# EAGLE schematic Adafruit Hallowing M4 (EAGLE 9.4.2)
COMPANY: ADAFRUIT INDUSTRIES; DRAWN: KTOWN; REV: B
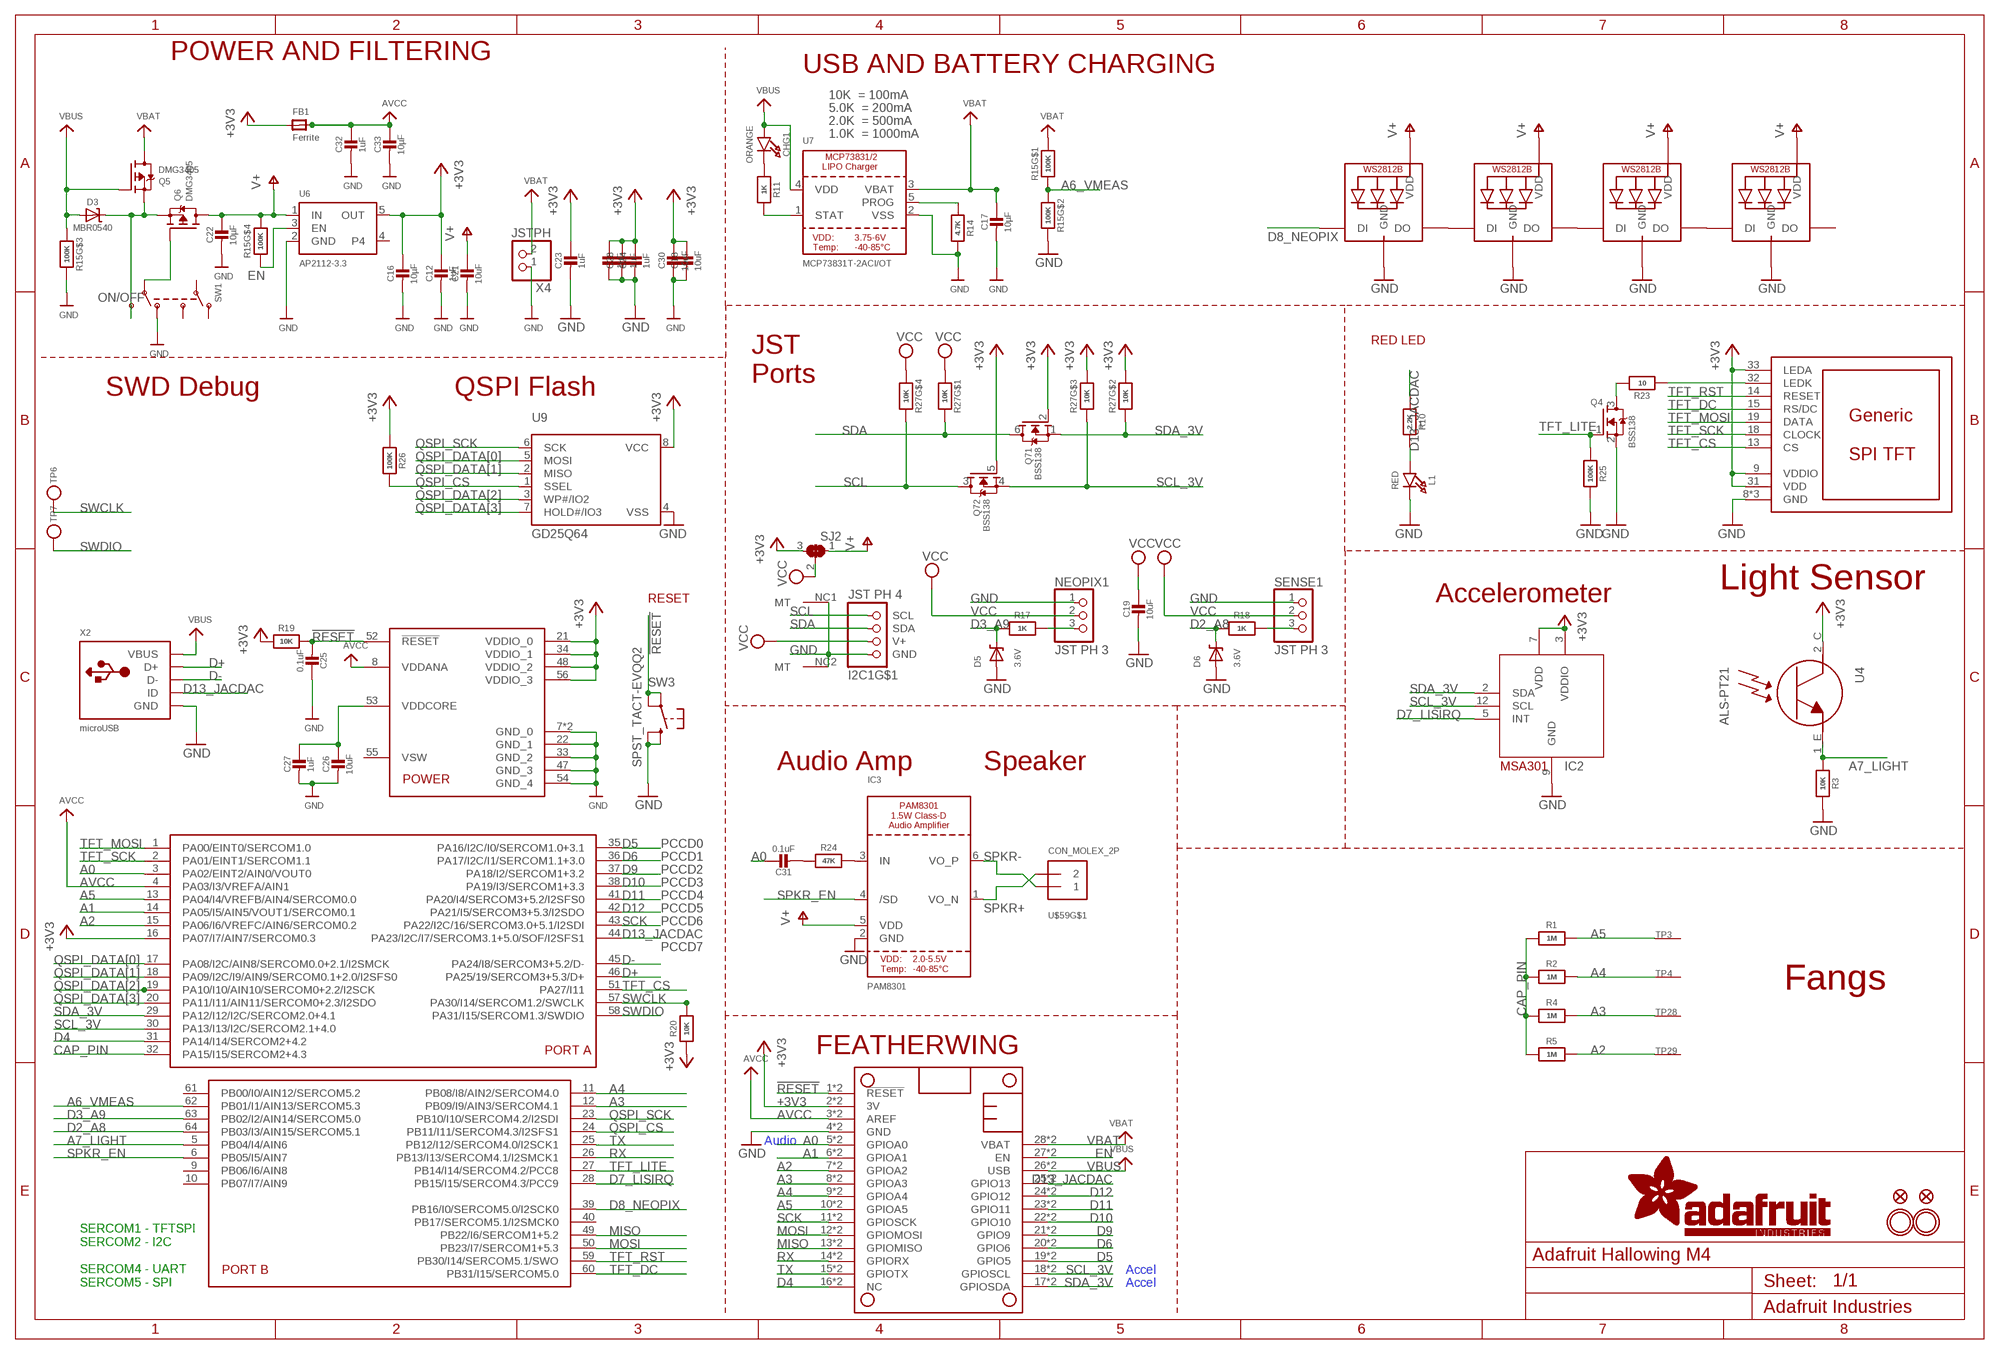
[diagram p0: schematic, sheet 1]

## Parts
C12  1uF  CAP_CERAMIC0603_NO  [0603-NO]
C16  10µF  CAP_CERAMIC0805-NOOUTLINE  [0805-NO]
C17  10µF  CAP_CERAMIC0805-NOOUTLINE  [0805-NO]
C18  10uF  CAP_CERAMIC0805-NOOUTLINE  [0805-NO]
C19  10uF  CAP_CERAMIC0805-NOOUTLINE  [0805-NO]
C21  10uF  CAP_CERAMIC0805-NOOUTLINE  [0805-NO]
C22  10µF  CAP_CERAMIC0805-NOOUTLINE  [0805-NO]
C23  1uF  CAP_CERAMIC0603_NO  [0603-NO]
C24  1uF  CAP_CERAMIC0603_NO  [0603-NO]
C25  0.1uF  CAP_CERAMIC0603_NO  [0603-NO]
C26  10uF  CAP_CERAMIC0805-NOOUTLINE  [0805-NO]
C27  1uF  CAP_CERAMIC0603_NO  [0603-NO]
C28  1uF  CAP_CERAMIC0603_NO  [0603-NO]
C29  1uF  CAP_CERAMIC0603_NO  [0603-NO]
C30  10uF  CAP_CERAMIC0805-NOOUTLINE  [0805-NO]
C31  0.1uF  CAP_CERAMIC0603_NO  [0603-NO]
C32  1uF  CAP_CERAMIC0603_NO  [0603-NO]
C33  10µF  CAP_CERAMIC0805-NOOUTLINE  [0805-NO]
CHG1  ORANGE  LED0805_NOOUTLINE  [CHIPLED_0805_NOOUTLINE]
D3  MBR0540  DIODE-SCHOTTKYSOD-123  [SOD-123]
D5  3.6V  DIODE-ZENERSOD323  [SOD-323]
D6  3.6V  DIODE-ZENERSOD323  [SOD-323]
FB1  Ferrite  FERRITE-0805NO  [0805-NO]
I2C1  JST PH 4  STEMMA_I2C_RASMT  [JSTPH4]
IC2  MSA301  [LGA12_2X2MM]
IC3  PAM8301  [SOT23-6]
L1  RED  LED0805_NOOUTLINE  [CHIPLED_0805_NOOUTLINE]
LED1  WS2812B_4020  [WS2812B_4020]
LED2  WS2812B_4020  [WS2812B_4020]
LED3  WS2812B_4020  [WS2812B_4020]
LED4  WS2812B_4020  [WS2812B_4020]
MS2  FEATHERWING_SMTDUALNOHOLES  [FEATHERWING_SMT_NOHOLES]
NEOPIX1  JST PH 3  CON_JST_PH_3PIN  [JSTPH3]
Q4  BSS138  MOSFET-NWIDE  [SOT23-WIDE]
Q5  DMG3405  MOSFET-P  [SOT23-R]
Q6  DMG3405  MOSFET-P  [SOT23-R]
Q7  BSS138  MOSFET-N_DUAL  [SOT363]
R1  1M  RESISTOR_0603_NOOUT  [0603-NO]
R2  1M  RESISTOR_0603_NOOUT  [0603-NO]
R3  10K  RESISTOR_0603_NOOUT  [0603-NO]
R4  1M  RESISTOR_0603_NOOUT  [0603-NO]
R5  1M  RESISTOR_0603_NOOUT  [0603-NO]
R10  2.2K  RESISTOR_0603_NOOUT  [0603-NO]
R11  1K  RESISTOR_0603_NOOUT  [0603-NO]
R14  4.7K  RESISTOR_0603_NOOUT  [0603-NO]
R15  100K  RESISTOR_4PACK  [RESPACK_4X0603]
R17  1K  RESISTOR_0603_NOOUT  [0603-NO]
R18  1K  RESISTOR_0603_NOOUT  [0603-NO]
R19  10K  RESISTOR_0603_NOOUT  [0603-NO]
R20  10K  RESISTOR_0603_NOOUT  [0603-NO]
R23  10  RESISTOR_0603_NOOUT  [0603-NO]
R24  47K  RESISTOR_0603_NOOUT  [0603-NO]
R25  100K  RESISTOR_0603_NOOUT  [0603-NO]
R26  100K  RESISTOR_0603_NOOUT  [0603-NO]
R27  10K  RESISTOR_4PACK  [RESPACK_4X0603]
SENSE1  JST PH 3  CON_JST_PH_3PIN  [JSTPH3]
SJ2  SOLDERJUMPER_2WAY  [SOLDERJUMPER_2WAY_OPEN_NOPASTE]
SW1  SWITCH_DPDTEG1390  [EG1390]
SW3  SPST_TACT-EVQQ2  SWITCH_TACT_SMT4.6X2.8  [BTN_KMR2_4.6X2.8]
TFT1  DISP_LCD_GENERIC_SPITFT_VDDIO_1.54_240X240_HANDSOLDER  [TFT_1.54IN_240X240_HANDSOLDER]
TP3  SEWTAP_ALLILONG  [PCB_ALLI_LONG]
TP4  SEWTAPPCB_ALLIGATOR  [PCB_ALLI]
TP6  TESTPOINTROUND1.5MM  [TESTPOINT_ROUND_1.5MM]
TP7  TESTPOINTROUND1.5MM  [TESTPOINT_ROUND_1.5MM]
TP28  SEWTAPPCB_ALLIGATOR  [PCB_ALLI]
TP29  SEWTAP_ALLILONG  [PCB_ALLI_LONG]
U4  ALS-PT21  PHOTOTRANSISTOR_PT26-21C  [ALS-PT26-21C]
U6  AP2112-3.3  VREG_SOT23-5  [SOT23-5]
U7  MCP73831T-2ACI/OT  MCP73831/2  [SOT23-5]
U9  GD25Q64  SPIFLASH_8PIN208MIL  [SOIC8_208MIL]
U$31  MOUNTINGHOLE2.5  [MOUNTINGHOLE_2.5_PLATED]
U$32  MOUNTINGHOLE2.5  [MOUNTINGHOLE_2.5_PLATED]
U$34  FIDUCIAL_1MM  [FIDUCIAL_1MM]
U$35  FIDUCIAL_1MM  [FIDUCIAL_1MM]
U$59  CON_MOLEX_2P  [53398-0271]
U$63  ATSAMD51J19  ATSAMD51J  [PQFN64-1]
X2  microUSB  USB_MICRO_20329_V2  [4UCONN_20329_V2]
X4  JSTPH  CON_JST_PH_2PIN  [JSTPH2]

## Nets
!RESET: C25.2 MS2.1(!RESET) MS2.1B(!RESET) R19.2 SW3.A'(P1) SW3.A(P) U$63.52(!RESET)
+3V3 [power]: C12.1 C16.1 C18.1 C23.1 C24.1 C28.1 C29.1 C30.1 FB1.1 IC2.3(VDDIO) IC2.7(VDD) MS2.2(3V) MS2.2B(3V) Q7.2(1:G) Q7.5(2:G) R19.1 R20.1 R26.1 R27.2 R27.3 SJ2.3 TFT1.9(VDDIO) TFT1.31(VDD) TFT1.33(LEDA) U4.2_C(C) U6.5(OUT) U9.8(VCC) U$63.16(PA07/I7/AIN7/SERCOM0.3) U$63.21(VDDIO_0) U$63.34(VDDIO_1) U$63.48(VDDIO_2) U$63.56(VDDIO_3)
A0: C31.1 MS2.5(GPIOA0) MS2.5B(GPIOA0) U$63.3(PA02/EINT2/AIN0/VOUT0)
A1: MS2.6(GPIOA1) MS2.6B(GPIOA1) U$63.14(PA05/I5/AIN5/VOUT1/SERCOM0.1)
A2: MS2.7(GPIOA2) MS2.7B(GPIOA2) R5.1 TP29.P$1(SEW) U$63.15(PA06/I6/VREFC/AIN6/SERCOM0.2)
A3: MS2.8(GPIOA3) MS2.8B(GPIOA3) R4.1 TP28.P$1(SEW) U$63.12(PB09/I9/AIN3/SERCOM4.1)
A4: MS2.9(GPIOA4) MS2.9B(GPIOA4) R2.1 TP4.P$1(SEW) U$63.11(PB08/I8/AIN2/SERCOM4.0)
A5: MS2.10(GPIOA5) MS2.10B(GPIOA5) R1.1 TP3.P$1(SEW) U$63.13(PA04/I4/VREFB/AIN4/SERCOM0.0)
A6_VMEAS: R15.1 R15.2 U$63.62(PB01/I1/AIN13/SERCOM5.3)
A7_LIGHT: R3.2 U4.1_E(E) U$63.5(PB04/I4/AIN6)
AVCC: C32.1 C33.1 FB1.2 MS2.3(AREF) MS2.3B(AREF) U$63.4(PA03/I3/VREFA/AIN1) U$63.8(VDDANA)
CAP_PIN: R1.2 R2.2 R4.2 R5.2 U$63.32(PA15/I15/SERCOM2+4.3)
CHG_LED1: R11.2 U7.1(STAT)
CHG_RATE1: R14.1 U7.5(PROG)
D2: R18.1 SENSE1.3
D2_A8: D6.C R18.2 U$63.64(PB03/I3/AIN15/SERCOM5.1)
D3: NEOPIX1.3 R17.1
D3_A9: D5.C R17.2 U$63.63(PB02/I2/AIN14/SERCOM5.0)
D4: MS2.16(NC) MS2.16B(NC) U$63.31(PA14/I14/SERCOM2+4.2)
D5: MS2.19(GPIO5) MS2.19B(GPIO5) U$63.35(PA16/I2C/I0/SERCOM1.0+3.1)
D6: MS2.20(GPIO6) MS2.20B(GPIO6) U$63.36(PA17/I2C/I1/SERCOM1.1+3.0)
D7_LISIRQ: IC2.5(INT) U$63.28(PB15/I15/SERCOM4.3/PCC9)
D8_NEOPIX: LED2.1(DI) U$63.39(PB16/I0/SERCOM5.0/I2SCK0)
D9: MS2.21(GPIO9) MS2.21B(GPIO9) U$63.37(PA18/I2/SERCOM1+3.2)
D10: MS2.22(GPIO10) MS2.22B(GPIO10) U$63.38(PA19/I3/SERCOM1+3.3)
D11: MS2.23(GPIO11) MS2.23B(GPIO11) U$63.41(PA20/I4/SERCOM3+5.2/I2SFS0)
D12: MS2.24(GPIO12) MS2.24B(GPIO12) U$63.42(PA21/I5/SERCOM3+5.3/I2SDO)
D13_JACDAC: MS2.25(GPIO13) MS2.25B(GPIO13) R10.1 U$63.44(PA23/I2C/I7/SERCOM3.1+5.0/SOF/I2SFS1) X2.ID
D+: U$63.46(PA25/19/SERCOM3+5.3/D+) X2.D+
D-: U$63.45(PA24/I8/SERCOM3+5.2/D-) X2.D-
EN: MS2.27(EN) MS2.27B(EN) R15.4 U6.3(EN)
GND: C12.2 C16.2 C17.2 C18.2 C19.2 C21.2 C22.2 C23.2 C24.2 C25.1 C26.2 C27.2 C28.2 C29.2 C30.2 C32.2 C33.2 D5.A D6.A I2C1.1(GND) I2C1.NC1(MT) I2C1.NC2(MT) IC2.9(GND) IC3.2(GND) L1.C LED1.4(GND) LED2.4(GND) LED3.4(GND) LED4.4(GND) MS2.4(GND) MS2.4B(GND) NEOPIX1.1 Q4.2(S) R3.1 R14.2 R15.6 R15.7 R25.2 SENSE1.1 SW1.O2 SW3.B'(S1) SW3.B(S) TFT1.8(GND) TFT1.21(GND) TFT1.22(GND) U6.2(GND) U7.2(VSS) U9.4(VSS) U$63.7(GND_0) U$63.22(GND_1) U$63.33(GND_2) U$63.47(GND_3) U$63.54(GND_4) U$63.EXP(GND_0) X2.BASE@1(GND) X2.BASE@2(GND) X2.GND X2.SPRT@1(GND) X2.SPRT@2(GND) X2.SPRT@3(GND) X2.SPRT@4(GND) X4.1
MISO: MS2.13(GPIOMISO) MS2.13B(GPIOMISO) U$63.49(PB22/I6/SERCOM1+5.2)
MOSI: MS2.12(GPIOMOSI) MS2.12B(GPIOMOSI) U$63.50(PB23/I7/SERCOM1+5.3)
N$1: R23.1 TFT1.32(LEDK)
N$3: L1.A R10.2
N$4: CHG1.C R11.1
N$5: D3.C Q5.2(S) Q6.2(S) SW1.S2
N$6: LED1.1(DI) LED2.3(DO)
N$7: LED1.3(DO) LED3.1(DI)
N$8: LED3.3(DO) LED4.1(DI)
N$12: Q4.3(D) R23.2
N$13: C31.2 R24.1
N$14: IC3.3(IN) R24.2
ON/OFF: Q6.1(G) SW1.P2
QSPI_CS: R26.2 U9.1(SSEL) U$63.24(PB11/I11/SERCOM4.3/I2SFS1)
QSPI_DATA[0]: U9.5(MOSI) U$63.17(PA08/I2C/AIN8/SERCOM0.0+2.1/I2SMCK)
QSPI_DATA[1]: U9.2(MISO) U$63.18(PA09/I2C/I9/AIN9/SERCOM0.1+2.0/I2SFS0)
QSPI_DATA[2]: U9.3(WP#/IO2) U$63.19(PA10/I10/AIN10/SERCOM0+2.2/I2SCK)
QSPI_DATA[3]: U9.7(HOLD#/IO3) U$63.20(PA11/I11/AIN11/SERCOM0+2.3/I2SDO)
QSPI_SCK: U9.6(SCK) U$63.23(PB10/I10/SERCOM4.2/I2SDI)
RX: MS2.14(GPIORX) MS2.14B(GPIORX) U$63.26(PB13/I13/SERCOM4.1/I2SMCK1)
SCK: MS2.11(GPIOSCK) MS2.11B(GPIOSCK) U$63.43(PA22/I2C/16/SERCOM3.0+5.1/I2SDI)
SCL: I2C1.4(SCL) Q7.3(2:D) R27.5
SCL_3V: IC2.12(SCL) MS2.18(GPIOSCL) MS2.18B(GPIOSCL) Q7.4(2:S) R27.6 U$63.30(PA13/I13/I2C/SERCOM2.1+4.0)
SDA: I2C1.3(SDA) Q7.6(1:D) R27.8
SDA_3V: IC2.2(SDA) MS2.17(GPIOSDA) MS2.17B(GPIOSDA) Q7.1(1:S) R27.7 U$63.29(PA12/I12/I2C/SERCOM2.0+4.1)
SPKR+: IC3.1(VO_N) U$59.2
SPKR-: IC3.6(VO_P) U$59.1
SPKR_EN: IC3.4(/SD) U$63.6(PB05/I5/AIN7)
SWCLK: R20.2 TP6.P$1 U$63.57(PA30/I14/SERCOM1.2/SWCLK)
SWDIO: TP7.P$1 U$63.58(PA31/I15/SERCOM1.3/SWDIO)
TFT_CS: TFT1.13(CS) U$63.51(PA27/I11)
TFT_DC: TFT1.15(RS/DC) U$63.60(PB31/I15/SERCOM5.0)
TFT_LITE: Q4.1(G) R25.1 U$63.27(PB14/I14/SERCOM4.2/PCC8)
TFT_MOSI: TFT1.19(DATA) U$63.1(PA00/EINT0/SERCOM1.0)
TFT_RST: TFT1.14(RESET) U$63.59(PB30/I14/SERCOM5.1/SWO)
TFT_SCK: TFT1.18(CLOCK) U$63.2(PA01/EINT1/SERCOM1.1)
TX: MS2.15(GPIOTX) MS2.15B(GPIOTX) U$63.25(PB12/I12/SERCOM4.0/I2SCK1)
V+ [power]: C21.1 C22.1 IC3.5(VDD) LED1.2(VDD) LED2.2(VDD) LED3.2(VDD) LED4.2(VDD) Q6.3(D) R15.5 SJ2.1 U6.1(IN)
VBAT [power]: C17.1 MS2.28(VBAT) MS2.28B(VBAT) Q5.3(D) R15.8 U7.3(VBAT) X4.2
VBUS [power]: CHG1.A D3.A MS2.26(USB) MS2.26B(USB) Q5.1(G) R15.3 U7.4(VDD) X2.VBUS
VCC [power]: C19.1 I2C1.2(V+) NEOPIX1.2 R27.1 R27.4 SENSE1.2 SJ2.2
VDDCORE2: C26.1 C27.1 U$63.53(VDDCORE)
Unconnected: LED4.3(DO) SW1.O1 SW1.P1 SW1.S1 U6.4 U$59.M1(MT) U$59.M2(MT) U$63.9(PB06/I6/AIN8) U$63.10(PB07/I7/AIN9) U$63.40(PB17/SERCOM5.1/I2SMCK0) U$63.55(VSW) U$63.61(PB00/I0/AIN12/SERCOM5.2)

## Notes on the sheet
- POWER AND FILTERING
- USB AND BATTERY CHARGING
- 10K  = 100mA
- 5.0K  = 200mA
- 2.0K  = 500mA
- 1.0K  = 1000mA
- RED LED
- JST
  Ports
- SWD Debug | QSPI Flash
- Light Sensor
- RESET | Accelerometer
- Audio Amp | Speaker
- PCCD0
- PCCD1
- PCCD2
- PCCD3
- PCCD4
- PCCD5
- PCCD6
- PCCD7
- Fangs
- FEATHERWING
- Audio
- Accel
- SERCOM1 - TFTSPI
  SERCOM2 - I2C
  
  SERCOM4 - UART
  SERCOM5 - SPI
- Accel

## Library data of the parts
C12 C17-C19 C21-C33 = microbuilder:CAP_CERAMIC: Ceramic Capacitors For new designs, use the packages preceded by an '_' character since they are more reliable: The following footprints should be used on most boards: _0402 - Standard footprint for regular board layouts _0603 - Standard footprint for regular board layouts _0805 - Standard footprint for regular board layouts _1206 - Standard footprint for regular board layouts For extremely tight-pitch boards where space is at a premium, the following 'micro-pitch' footprints can be used (smaller pads, no silkscreen outline, etc.): _0402MP - Micro-pitch footprint for very dense/compact boards _0603MP - Micro-pitch footprint for very dense/compact boards _0805MP - Micro-pitch footprint for very dense/compact boards _1206MP - Micro-pitch footprint for very dense/compact boards
C16 = microbuilder:CAP_CERAMIC: Ceramic Capacitors For new designs, use the packages preceded by an '_' character since they are more reliable: The following footprints should be used on most boards: _0402 - Standard footprint for regular board layouts _0603 - Standard footprint for regular board layouts _0805 - Standard footprint for regular board layouts _1206 - Standard footprint for regular board layouts For extremely tight-pitch boards where space is at a premium, the following 'micro-pitch' footprints can be used (smaller pads, no silkscreen outline, etc.): _0402MP - Micro-pitch footprint for very dense/compact boards _0603MP - Micro-pitch footprint for very dense/compact boards _0805MP - Micro-pitch footprint for very dense/compact boards _1206MP - Micro-pitch footprint for very dense/compact boards; REV: C
CHG1 L1 = microbuilder:LED: LED 0603 - 0603 Surface Mount Package 2mA: Green LED - Low Power (3.9mcd, 2ma, 1.7Vf) - Digikey: 475-2709-2-ND Orange LED - Low Power (9.8mcd, 2ma, 1.8Vf) - Digikey: 475-1194-2-ND Red LED - Low Power (5mcd, 2ma, 1.8Vf) - Digikey: 475-1195-2-ND Yellow LED - Low Power (7mcd, 2ma, 1.8Vf) - Digikey: 475-1196-2-ND 5mA: Blue LED - Low Power (17mcd, 5ma, 2.9Vf) - Digikey: LNJ937W8CRACT-ND 0805 - 0805 Surface Mount Package 2mA: Red LED (8.8mcd, 2mA, 1.8Vf, Clear) - Low Power [Digikey: 475-2510-1-ND] Green LED (5mcd, 2mA, 1.8Vf, Clear) - Low Power [Digikey: 475-2730-1-ND] Yellow LED (11.3mcd, 2mA, 1.8Vf, Clear) - Low Power [Digikey: 475-2555-1-ND] 20mA: Red LED (104mcd, 20mA, Diffused) - LS R976 [Digikey: 475-1278-6-ND] Red LED (12mcd, 20mA, 2.0Vf, Clear) - APT2012EC [Digikey: 754-1128-1-ND] Green LED (15mcd, 20mA, 2.2Vf, Clear) - APT2012GC [Digikey: 754-1131-1-ND] Orange LED (160mcd, 20mA, 2.1Vf, Clear) - APT2012SECK [Digikey: 754-1130-1-ND] 1206 - 1206 Surface Mount Package Green LED (26mcd, 20mA, Diffused) - LG N971 [Digikey: 475-1407-6-ND] Red LED (15mcd, 20mA, Diffused) - LH N974 [Digikey: 475-1416-6-ND] Cree - Cree High-Power Surface Mount LEDs XPEBWT-L1-0000-00D50 - White 111lm 350mA 2.9Vf 6200K 110° XTEAWT-00-0000-00000LEE3 - White 114lm 350mA 2.85Vf 5000K 115° Everlight - Everlight 45-21 Series Surface Mount LEDs 45-21/QK2C-B2832AC2CB2/2T - Warm White 2000mcd 20mA 3.25Vf 3050K 120° 45-21/LK2C-B38452C4CB2/2T - Nuetral White 2000mcd 20mA 3.25Vf 4150K 120° 45-21/LK2C-B50634C6CB2/2T - Cold White 2200mcd 20mA 3.25Vf 5650K 120° PLCC2 Reverse Mount LS T77K-J1L2-1-0-2-R18-Z - Red 11.25mcd 2mA 1.8Vf 630nm 120° LO T77K-L1M2-24-Z - Orange 19.6mcd 2mA 1.8Vf 606nm 120° LY T77K-K2M1-26-Z - Yellow 15.7mcd 2mA 1.8Vf 587nm 120°
D3 = microbuilder:DIODE-SCHOTTKY
D5 D6 = microbuilder:DIODE-ZENER: Zener Diode SMA: 30V 1W Zener Diode, 1.2Vf - Digikey: SMAZ30-FDICT-ND
FB1 = microbuilder:FERRITE: Ferrite Bead 0603 MMZ1608B121C - 120 Ohm @ 100MHz, 600mA, 0.15 Ohm DC Resistance - Digikey: 445-2164-1-ND BK1608HW121-T - 120 Ohm, 600mA Ferrite Chip - Digikey: 587-1876-2-ND 0805 HZ0805B272R-10 - 2.7K Ohm @ 100MHz, 200mA, 0.8 Ohm DC Resistance - Digikey: 240-2504-1-ND (see also Murata BLM21BD272SN1L) MMZ2012Y152B - 1.5K Ohm @ 100MHz, 500mA, 0.4 Ohm DC Resistance - Digikey: 445-1560-1-ND - Mainly for high frequency (80-400MHz) MMZ2012R102A - 1K Ohm @ 100MHz, 500mA, 0.3 Ohm DC Resistance - Digikey: 445-1555-2-ND - More general purpose (10-200MHz)
I2C1 = microbuilder:STEMMA_I2C
IC2 = microbuilder:MSA301
IC3 = microbuilder:PAM8301
LED1-LED4 = microbuilder:WS2812B
MS2 = microbuilder:FEATHERWING
NEOPIX1 SENSE1 = microbuilder:CON_JST_PH_3PIN
Q4 = microbuilder:MOSFET-N: N-Channel Mosfet LEGEND VDS: Voltage Drain-Source ID: Drain Current RDS(ON): Drain-Source On-State Resistance VGS(TH): Gate-Source Threshold Voltage CISS: Drain-Source Input Capacitance SOT-23 Name VDS ID RDS(ON) VGS(TH) CISS Order Number 2N7002E 60V 260mA 2.5 Ohm 2.5V @ 250uA 26.7pF @ 25V 2N7002ET1GOSTR-ND BSH103 30V 850mA 400 mOhm 400mV @ 1mA 83pF @ 24V BSH103,235-ND BSS138 60V 320mA 1.6 Ohm 1.5V @ 250uA 50pF @ 10V Mouser: 771-BSS138PW115 DMN2075U-7 20V 4.2A 38 mOhm 1V @ 250 uA 594.3pF @ 10V DMN2075U-7DICT-ND * BSS138 good choice for I2C level-shifting POWERPAK 1212-8 Name VDS ID RDS(ON) VGS(TH) CISS Order Number Si7308DN 60V 6A 58 mOhm 3V @ 250uA 665pF @ 15V SI7308DN-T1-E3CT-ND
Q5 Q6 = microbuilder:MOSFET-P: P-Channel Mosfet LEGEND VDS: Voltage Drain-Source ID: Drain Current RDS(ON): Drain-Source On-State Resistance VGS(TH): Gate-Source Threshold Voltage CISS: Drain-Source Input Capacitance SOT-23 Name VDS ID RDS(ON) VGS(TH) CISS Order Number IRLML5103 30V 760mA 600 mOhm -- 75pF @ 25V Digikey: IRLML5103PBFCT-ND IRLML6401 12V 4.3A 50 mOhm 950mV @ 250µA 830pF @ 10V Digikey: IRLML6401PBFTR-ND NTR0202PL 20V 400mA 800 mOhm 2.3V @ 250uA 70pF @ 5V Digikey: NTR0202PLT1GOSTR-ND NTR4101PT1G 20V 1.8A 85 mOhm 1.2V @ 250uA 675pF @ 10V Digikey: NTR4101PT1GOSCT-ND DMP2004K 20V 600mA 900 mOhm 1V @ 250uA 175pF @ 16V Digikey: DMP2004KDICT-ND PMV65XP 20V 3.9A 76 mOhm 950mV @ 1mA 725pF @ 20V Digikey: 568-2358-2-ND TO-252 Name VDS ID RDS(ON) VGS(TH) CISS Order Number AOD417 30V 25A 34 mOhm 3V @ 250µA 920pF @ 15V Digikey: 785-1106-2-ND PowerPak Name VDS ID RDS(ON) VGS(TH) CISS Order Number AON7401 30V 12A 14 mOhm 3V @ 250µA 2600pF @ 15V Digikey: 785-1302-1-ND
Q7 = microbuilder:MOSFET-N_DUAL: Dual N-Channel MOSFET SOT363 (2.0x1.25mm) 2N7002PS - 60V, 320mA [Digikey: 568-5984-1-ND]
R1-R5 R10 R11 R14 R17-R20 R23-R26 = microbuilder:RESISTOR: Resistors For new designs, use the packages preceded by an '_' character since they are more reliable: The following footprints should be used on most boards: _0402 - Standard footprint for regular board layouts _0603 - Standard footprint for regular board layouts _0805 - Standard footprint for regular board layouts _1206 - Standard footprint for regular board layouts For extremely tight-pitch boards where space is at a premium, the following 'micro-pitch' footprints can be used (smaller pads, no silkscreen outline, etc.): _0402MP - Micro-pitch footprint for very dense/compact boards _0603MP - Micro-pitch footprint for very dense/compact boards _0805MP - Micro-pitch footprint for very dense/compact boards _1206MP - Micro-pitch footprint for very dense/compact boards
R15 R27 = microbuilder:RESISTOR_4PACK: Resistor Packs (4 resistors) 4 x 0603 10K 1/16W - Digikey: YC164J-10KCT-ND
SJ2 = microbuilder:SOLDERJUMPER_2WAY: 2-Way Solder Jumper
SW1 = microbuilder:SWITCH_DPDT: Switch - DPDT A DPDT Switch acts like an SPDT switch, but has a pair of switches instead of just one. Vertical - 0.3A @ 6V SMT - Digikey: JS202011SCQN
SW3 = microbuilder:SWITCH_TACT_SMT: SMT Tact Switches 6x6mm - Digikey: P12940SCT-ND KMR2 (4.6x2.8mm) - Digikey: 401-1426-1-ND EVQ-PQHB55 - Light Touch, 160GF (4.5x4.5mm) - Digikey: P8090SCT-ND KMT0 - KMT021 NGJ LHS (etc.) IP68/Waterproof - Digikey: CKN10289CT-ND
TFT1 = microbuilder:DISP_LCD_GENERIC_SPITFT_VDDIO
TP3 TP4 TP28 TP29 = microbuilder:SEWTAP
TP6 TP7 = microbuilder:TESTPOINT: Test Point Various test points for characterisation and PCB testing TESTPOINT_SMT - Compact Surface Mount Test Point [Digikey: 5016KTR-ND]
U4 = microbuilder:PHOTOTRANSISTOR: ALS-PT19-315C - Analog Light Sensor VCC: 2.5-5.5V
U6 = microbuilder:VREG_SOT23-5: SOT23-5 Fixed Voltage Regulators Part Current Out V Out V In V Dropout θJA (°C/W) TJ (°C) Digikey Part No. ADP121 150mA 3.3V 3.4-5.5V 0.09V @ 150mA -- -- ADP121-AUJZ33R7CT-ND ADP121 150mA 3.0V 3.1-5.5V 0.09V @ 150mA -- -- ADP121-AUJZ30R7CT-ND ADP122 300mA 3.3V 3.4-5.5V 0.085V @ 300mA -- -- ADP122AUJZ-3.3-R7CT-ND ADP1712 300mA 3.3V 3.5-5.5V 0.17V @ 300mA -- -- ADP1712AUJZ-3.3-R7TR-ND AP7311 (Low Cost) 150mA 3.3V 3.5-6V 0.15V @ 150mA -- -- AP7311-33WG-7DICT-ND LD39015M18R 150mA 1.8V 1.9V-5.5V 0.08V @ 100mA -- -- 497-6977-1-ND LP2985A-33DBVR 150mA 3.3V 3.3-16V 0.28V @ 150mA 206 150 296-18479-1-ND MCP1824T-3302E/OT 300mA 3.3V 3.5V-6V 0.2V @ 300mA -- -- MCP1824T-3302E/OTCT-ND MIC5205-2.5YM5 TR 150mA 2.5V 2.7-16V 0.165V @ 150mA -- -- 576-1257-2-ND MIC5205-3.0YM5 TR 150mA 3.0V 3.2V-16V 0.165V @ 150mA -- -- 576-1258-2-ND MIC5205-3.3YM5 TR 150mA 3.3V 3.5V-16V 0.165V @ 150mA -- -- 576-1259-2-ND TPS780330220 150mA 3.3V+2.2V 3.6-5.5V 250mV Max -- -- 296-23332-1-ND TDA3663/N1,135 100mA 3.3V 3.5-45V 0.18V @ 50mA -- -- 568-5343-1-ND Max operating temp can be calculated using θJA, TJ (max junction temperature), and power in watts. Set the "Maximum Ambient Temperature" until it reaches TJ ("Max Junction Temperature"), which is the absolute limit for safe use of the regulator: Heat Sink Temperature Calculator <http://www.daycounter.com/Calculators/Heat-Sink-Temperature-Calculator.phtml> For example, With 12V source into a 3.3V LP2985 and a 30mA load, we are dissipating (12V-3.3V) * 0.03A = 0.261W. With a θJA of 206 °C/W, a TJ of 150°C, and 261mW we can safely use the chip without a heat sink up to 75°C (=147.1°C Junction Temperature).
U7 = microbuilder:MCP73831/2: MCP73831/2 LIPO Charger VDD: 3.75 - 6V Temp -40 - 85°C Programmable Charge Rate: 15-500mA NOTE: STAT is a tri-state logic output on the MCP73831 and an open-drain output on the MCP73832. SOT23-5 with 4.2V output and tri-state logic on STAT = MCP73831T-2ACI/OT
U9 = microbuilder:SPIFLASH_8PIN: SOIC8 SPI Flash Be careful with the size since SOIC8 flash comes in several 'widths' SOIC8 150 mil M25P16 - 16Mbit (2Mbit x 8) Serial Flash (75MHz SPI Bus), Supply: 2.7-3.6V Digikey: SOIC8 - M25P16-VMN6P-ND SOIC8 208 mil W25Q16BVSSIG - 16Mbit (2Mbit x 8) Serial Flash (104MHz SPI Bus), Supply: 2.7-3.6V Digikey: SOIC8 - W25Q16BVSSIG-ND
U$31 U$32 = microbuilder:MOUNTINGHOLE: Mounting Hole For #2 screws (0.086"/2.18mm width, 0.094"/2.4mm hole) use 2.5mm; BOM: EXCLUDE
U$34 U$35 = microbuilder:FIDUCIAL: Fiducial Alignment Points Various fiducial points for machine vision alignment.; BOM: EXCLUDE
U$59 = microbuilder:CON_MOLEX_2P
U$63 = microbuilder:ATSAMD51J: ATSAMD51J cortex m4 microcontroller
X2 = microbuilder:USB: USB Connectors USBMINIB - Surface Mount Female Mini-B USB Connector 4UConnector: 06564
X4 = microbuilder:CON_JST_PH_2PIN: JST 2-Pin Right-Angle Connector PH-Series - 4UConnector: 17311 SH-Series - 4UConnector: 07278

## Net classes
1 power: width 0.305 mm
2 thickpower: width 0.406 mm